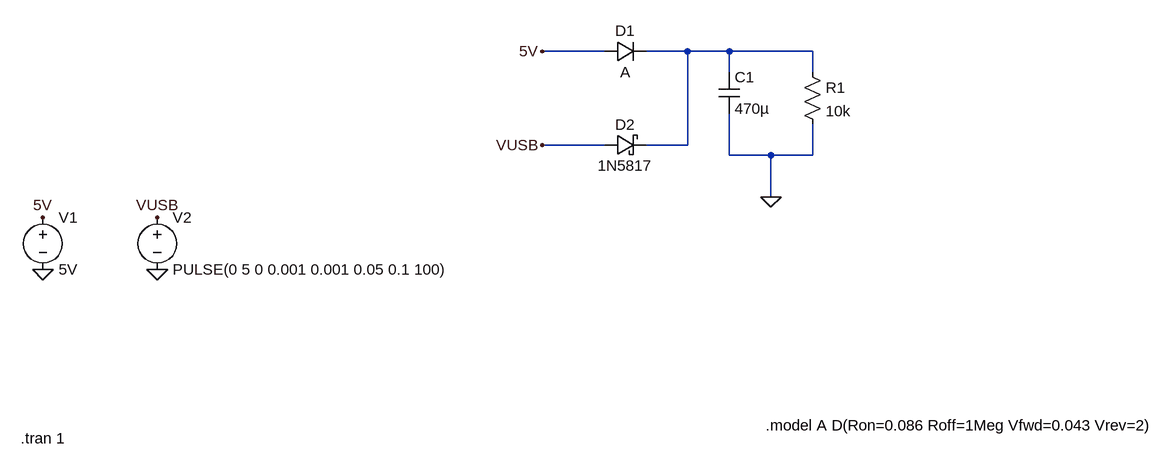
[diagram p0: schematic power_or_diodes.asc]
power_or_diodes.asc, the LTspice schematic file:
Version 4
SHEET 1 1736 680
WIRE 832 -96 736 -96
WIRE 960 -96 896 -96
WIRE 1024 -96 960 -96
WIRE 1152 -96 1024 -96
WIRE 1024 -64 1024 -96
WIRE 1152 -64 1152 -96
WIRE 832 48 736 48
WIRE 960 48 960 -96
WIRE 960 48 896 48
WIRE 1024 64 1024 0
WIRE 1088 64 1024 64
WIRE 1152 64 1152 16
WIRE 1152 64 1088 64
WIRE 1088 128 1088 64
FLAG 1088 128 0
FLAG 144 240 0
FLAG -32 240 0
FLAG -32 160 5V
FLAG 144 160 VUSB
FLAG 736 48 VUSB
FLAG 736 -96 5V
SYMBOL voltage -32 144 R0
WINDOW 123 0 0 Left 0
WINDOW 39 0 0 Left 0
SYMATTR InstName V1
SYMATTR Value 5V
SYMBOL voltage 144 144 R0
WINDOW 123 0 0 Left 0
WINDOW 39 0 0 Left 0
SYMATTR InstName V2
SYMATTR Value PULSE(0 5 0 0.001 0.001 0.05 0.1 100)
SYMBOL diode 832 -80 R270
WINDOW 0 32 32 VTop 2
WINDOW 3 0 32 VBottom 2
SYMATTR InstName D1
SYMATTR Value A
SYMBOL schottky 832 64 R270
WINDOW 0 32 32 VTop 2
WINDOW 3 0 32 VBottom 2
SYMATTR InstName D2
SYMATTR Value 1N5817
SYMATTR Description Diode
SYMATTR Type diode
SYMBOL res 1136 -80 R0
SYMATTR InstName R1
SYMATTR Value 10k
SYMBOL cap 1008 -64 R0
SYMATTR InstName C1
SYMATTR Value 470µ
TEXT 1080 480 Left 2 !.model A D(Ron=0.086 Roff=1Meg Vfwd=0.043 Vrev=2)
TEXT -66 500 Left 2 !.tran 1

The netlist it stands for:
* power_or_diodes.asc
V1 5V 0 5V
V2 VUSB 0 PULSE(0 5 0 0.001 0.001 0.05 0.1 100)
D1 5V N001 A
D2 VUSB N001 1N5817
R1 N001 0 10k
C1 N001 0 470µ
.model D D
.lib standard.dio
.model A D(Ron=0.086 Roff=1Meg Vfwd=0.043 Vrev=2)
.tran 1
.backanno
.end